# EAGLE design second (EAGLE 8.5.0)

## Sheet 1 of 2
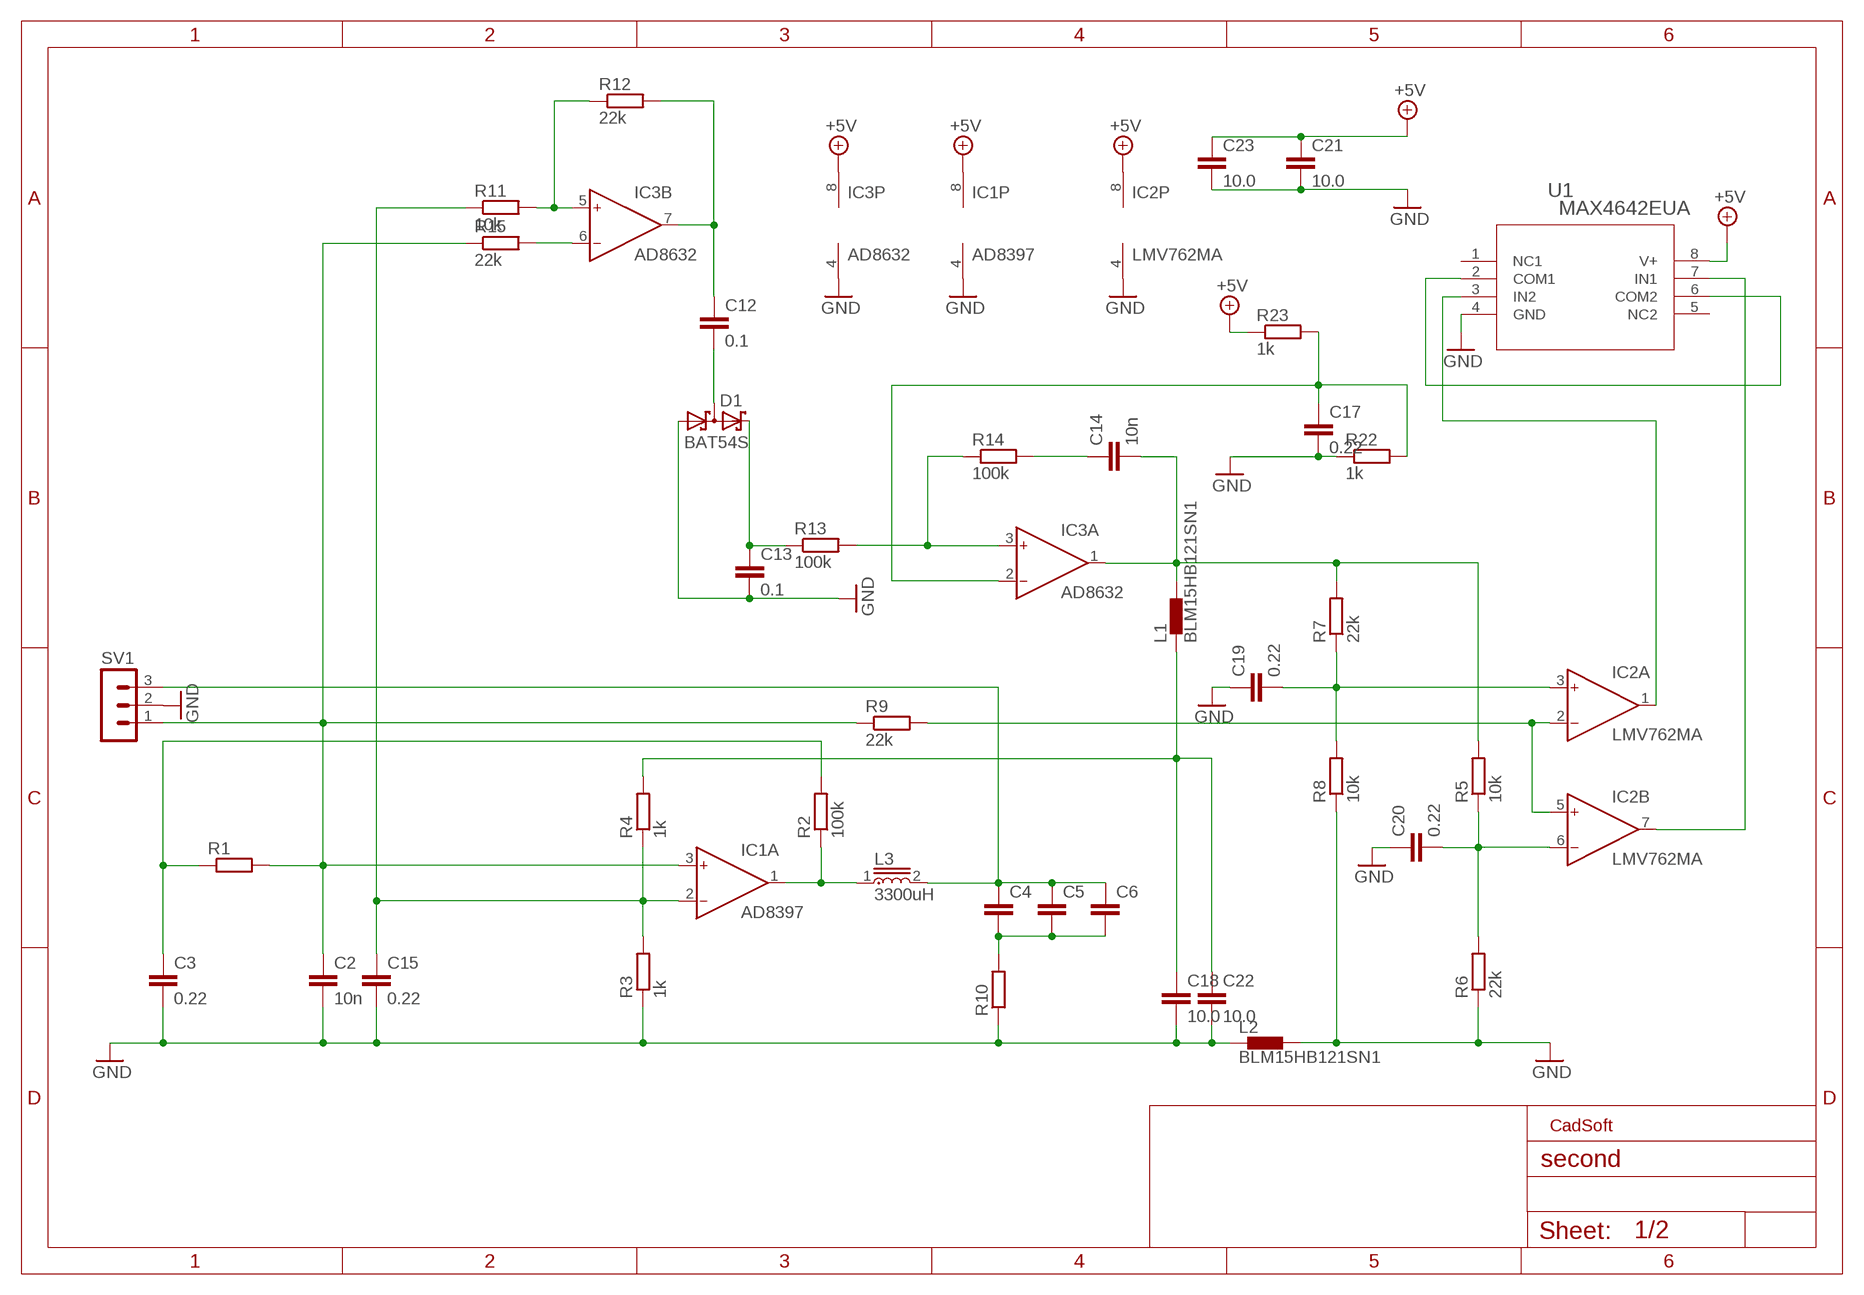
[diagram p0: schematic, sheet 1]

### Parts
C2  10n  C-EUC0805  [C0805]
C3  0.22  C-EUC0805  [C0805]
C4  C-EUC0805  [C0805]
C5  C-EUC0805  [C0805]
C6  C-EUC0805  [C0805]
C12  0.1  C-EUC0805  [C0805]
C13  0.1  C-EUC0805  [C0805]
C14  10n  C-EUC0805  [C0805]
C15  0.22  C-EUC0805  [C0805]
C17  0.22  C-EUC0805  [C0805]
C18  10.0  C-EUC0805  [C0805]
C19  0.22  C-EUC0805  [C0805]
C20  0.22  C-EUC0805  [C0805]
C21  10.0  C-EUC0805  [C0805]
C22  10.0  C-EUC0805  [C0805]
C23  10.0  C-EUC0805  [C0805]
D1  BAT54S  [SOT23]
IC1  AD8397  AD822R  [SO8]
IC2  LMV762MA  AD822R  [SO8]
IC3  AD8632  AD822R  [SO8]
L1  BLM15HB121SN1  [0402]
L2  BLM15HB121SN1  [0402]
L3  3300uH  P0762.103NL  [P0762NL]
R1  R-EU_R0805  [R0805]
R2  100k  R-EU_R0805  [R0805]
R3  1k  R-EU_R0805  [R0805]
R4  1k  R-EU_R0805  [R0805]
R5  10k  R-EU_R0805  [R0805]
R6  22k  R-EU_R0805  [R0805]
R7  22k  R-EU_R0805  [R0805]
R8  10k  R-EU_R0805  [R0805]
R9  22k  R-EU_R0805  [R0805]
R10  R-EU_R0805  [R0805]
R11  10k  R-EU_R0805  [R0805]
R12  22k  R-EU_R0805  [R0805]
R13  100k  R-EU_R0805  [R0805]
R14  100k  R-EU_R0805  [R0805]
R15  22k  R-EU_R0805  [R0805]
R22  1k  R-EU_R0805  [R0805]
R23  1k  R-EU_R0805  [R0805]
SV1  MA03-1  [MA03-1]
U1  MAX4642EUA  [21-0036K]

### Nets
+5V: C21.1 C23.1 IC1.8(P:V+) IC2.8(P:V+) IC3.8(P:V+) R23.1 U1.8(V+) ; also sheet 2
GND: C2.2 C3.2 C13.2 C15.2 C17.2 C18.2 C19.1 C20.1 C21.2 C22.2 C23.2 D1.1(A1) IC1.4(P:V-) IC2.4(P:V-) IC3.4(P:V-) L2.1 L2.2 R3.1 R6.1 R8.1 R10.1 R22.1 SV1.2 U1.4(GND) ; also sheet 2
N$1: IC2.1(A:OUT) U1.3(IN2)
N$2: U1.2(COM1) U1.6(COM2)
N$3: IC2.2(A:IN-) IC2.5(B:IN+) R9.2
N$4: C20.2 IC2.6(B:IN-) R5.1 R6.2
N$5: C19.2 IC2.3(A:IN+) R7.1 R8.2
N$7: C14.2 IC3.1(A:OUT) L1.2 R5.2 R7.2
N$8: C18.1 C22.1 L1.1 R4.2
N$9: IC2.7(B:OUT) U1.7(IN1)
N$10: C4.2 C5.2 C6.2 R10.2
N$11: C4.1 C5.1 C6.1 L3.2 SV1.3
N$13: C14.1 R14.2
N$14: IC3.3(A:IN+) R13.2 R14.1
N$16: IC1.1(A:OUT) L3.1 R2.1
N$17: C2.1 IC1.3(A:IN+) R1.2 R9.1 R15.1 SV1.1
N$19: C3.1 R1.1 R2.2
N$21: C13.1 D1.2(C2) R13.1
N$23: C12.2 D1.3(C1A2)
N$24: C12.1 IC3.7(B:OUT) R12.2
N$25: IC3.5(B:IN+) R11.2 R12.1
N$26: IC3.6(B:IN-) R15.2
N$28: C15.1 IC1.2(A:IN-) R3.2 R4.1 R11.1
N$30: C17.1 IC3.2(A:IN-) R22.2 R23.2
Unconnected: IC1.5(B:IN+) IC1.6(B:IN-) IC1.7(B:OUT) U1.1(NC1) U1.5(NC2)

### Notes on the sheet
- CadSoft

## Sheet 2 of 2
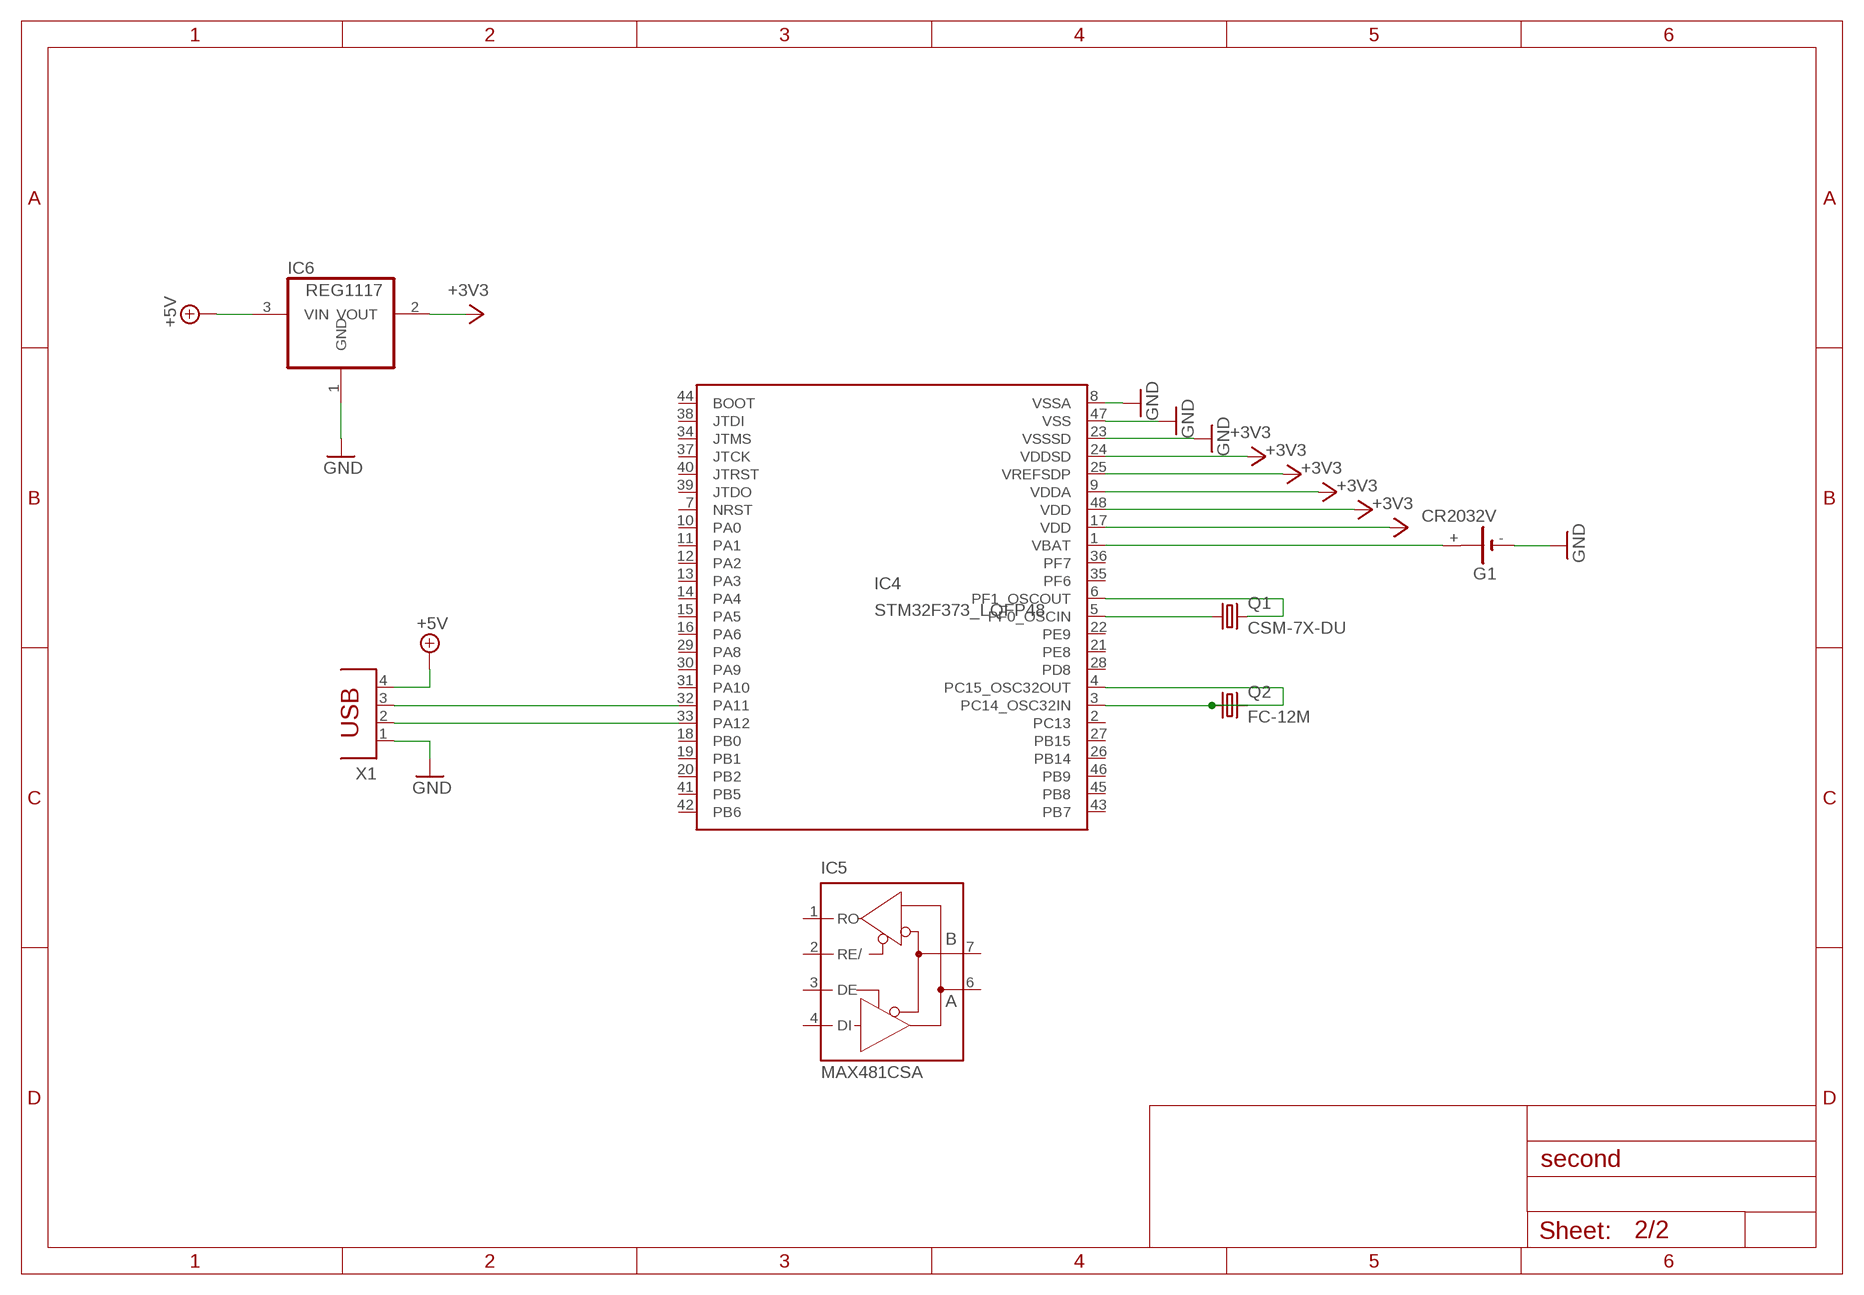
[diagram p1: schematic, sheet 2]

### Parts
G1  CR2032V  [CR2032V]
IC4  STM32F373_LQFP48  [LQFP48_PACKAGE]
IC5  MAX481CSA  [SO08]
IC6  REG1117  [SOT223]
Q1  CSM-7X-DU  [CSM-7X-DU]
Q2  FC-12M  [FC-12M]
X1  PN61729  [PN61729]

### Nets
+3V3: IC4.9(VDDA) IC4.17(VDD) IC4.24(VDDSD) IC4.25(VREFSDP) IC4.48(VDD) IC6.2(VOUT)
+5V: IC6.3(VIN) X1.4 ; also sheet 1
GND: G1.- IC4.8(VSSA) IC4.23(VSSSD) IC4.47(VSS) IC6.1(GND) X1.1 ; also sheet 1
N$6: G1.+ IC4.1(VBAT)
N$12: IC4.5(PF0_OSCIN) Q1.1
N$15: IC4.6(PF1_OSCOUT) Q1.2
N$18: IC4.3(PC14_OSC32IN) IC4.4(PC15_OSC32OUT) Q2.1
N$20: IC4.32(PA11) X1.3
N$22: IC4.33(PA12) X1.2
Unconnected: G1.+@1(+) IC4.2(PC13) IC4.7(NRST) IC4.10(PA0) IC4.11(PA1) IC4.12(PA2) IC4.13(PA3) IC4.14(PA4) IC4.15(PA5) IC4.16(PA6) IC4.18(PB0) IC4.19(PB1) IC4.20(PB2) IC4.21(PE8) IC4.22(PE9) IC4.26(PB14) IC4.27(PB15) IC4.28(PD8) IC4.29(PA8) IC4.30(PA9) IC4.31(PA10) IC4.34(JTMS) IC4.35(PF6) IC4.36(PF7) IC4.37(JTCK) IC4.38(JTDI) IC4.39(JTDO) IC4.40(JTRST) IC4.41(PB5) IC4.42(PB6) IC4.43(PB7) IC4.44(BOOT) IC4.45(PB8) IC4.46(PB9) IC5.1(RO) IC5.2(RE/) IC5.3(DE) IC5.4(DI) IC5.6(A) IC5.7(B) Q2.2

## Power pins joined to a net without a drawn wire
GND: IC5.5(GND)
VCC: IC5.8(VCC)

## Library data of the parts
C2-C6 C12-C15 C17-C23 = rcl:C-EU: CAPACITOR, European symbol; SPICEPREFIX: C
D1 = diode:BAT54S: Schottky Diodes Pin connection corrected 2011-05-04 Source: Fairchild .. BAT54.pdf
G1 = battery:CR2032V: LI BATTERY Varta
IC1-IC3 = analog-devices:AD822: Single-Supply, Rail-to-Rail Low Power FET-Input Op Amp Source: http://www.analog.com/static/imported-files/data_sheets/AD822.pdf; MF: ANALOG DEVICES; MPN: AD822BRZ; OC_FARNELL: 1651303
IC4 = analog:STM32F373_LQFP48: STM32F373_LQFP48 edit this description Auto generated by make-symbol-device-package-bsdl.ulp Rev. 44 Source: STM32F373_LQFP48.bsd
IC5 = maxim:MAX481CSA: RS485 TRANSEIVER; MF: MAXIM; MPN: MAX481CSA; OC_FARNELL: unknown; OC_NEWARK: 90C3817
IC6 = burr-brown:REG1117: 800mA and 1A Low Dropout (LDO) Positive Regulator 1.8V, 2.5V, 2.85V, 3.3V, 5V, and Adj; MPN: REG1117; OC_FARNELL: 1097566; OC_NEWARK: 14P6981
L1 L2 = inductors:BLM15H: EMIFIL (R) Chip Ferrite Bead for GHz Noise Source: http://www.murata.com/ Ferrite Bead BLM15H.pdf
L3 = inductors:P0762.*NL: Unshielded Drum Core P0762NL Series Source> http://ww2.pulseeng.com/products/datasheets/SPM2007.pdf; SPICEPREFIX: L
Q1 = crystal:CSM-7X-DU: SMD CRYSTAL Source: www.ecsxtal.com .. Crystal 3.6864MHz CSM_7X_DU.PDF; OC_FARNELL: unknown; OC_NEWARK: unknown
Q2 = crystal:FC-12M: kHz RANGE CRYSTAL UNIT LOW PROFILE SMD Source: Epson Toyocom FC-12M.pdf
R1-R15 R22 R23 = rcl:R-EU_: RESISTOR, European symbol; SPICEPREFIX: R
SV1 = con-lstb:MA03-1: PIN HEADER; OC_FARNELL: unknown; OC_NEWARK: unknown
U1 = analog:MAX4642EUA; MANUFACTURER_PART_NUMBER: max4642eua; VENDOR: Maxim Integrated Products
X1 = con-berg:PN61729: BERG USB connector; OC_FARNELL: unknown; OC_NEWARK: unknown

## Board
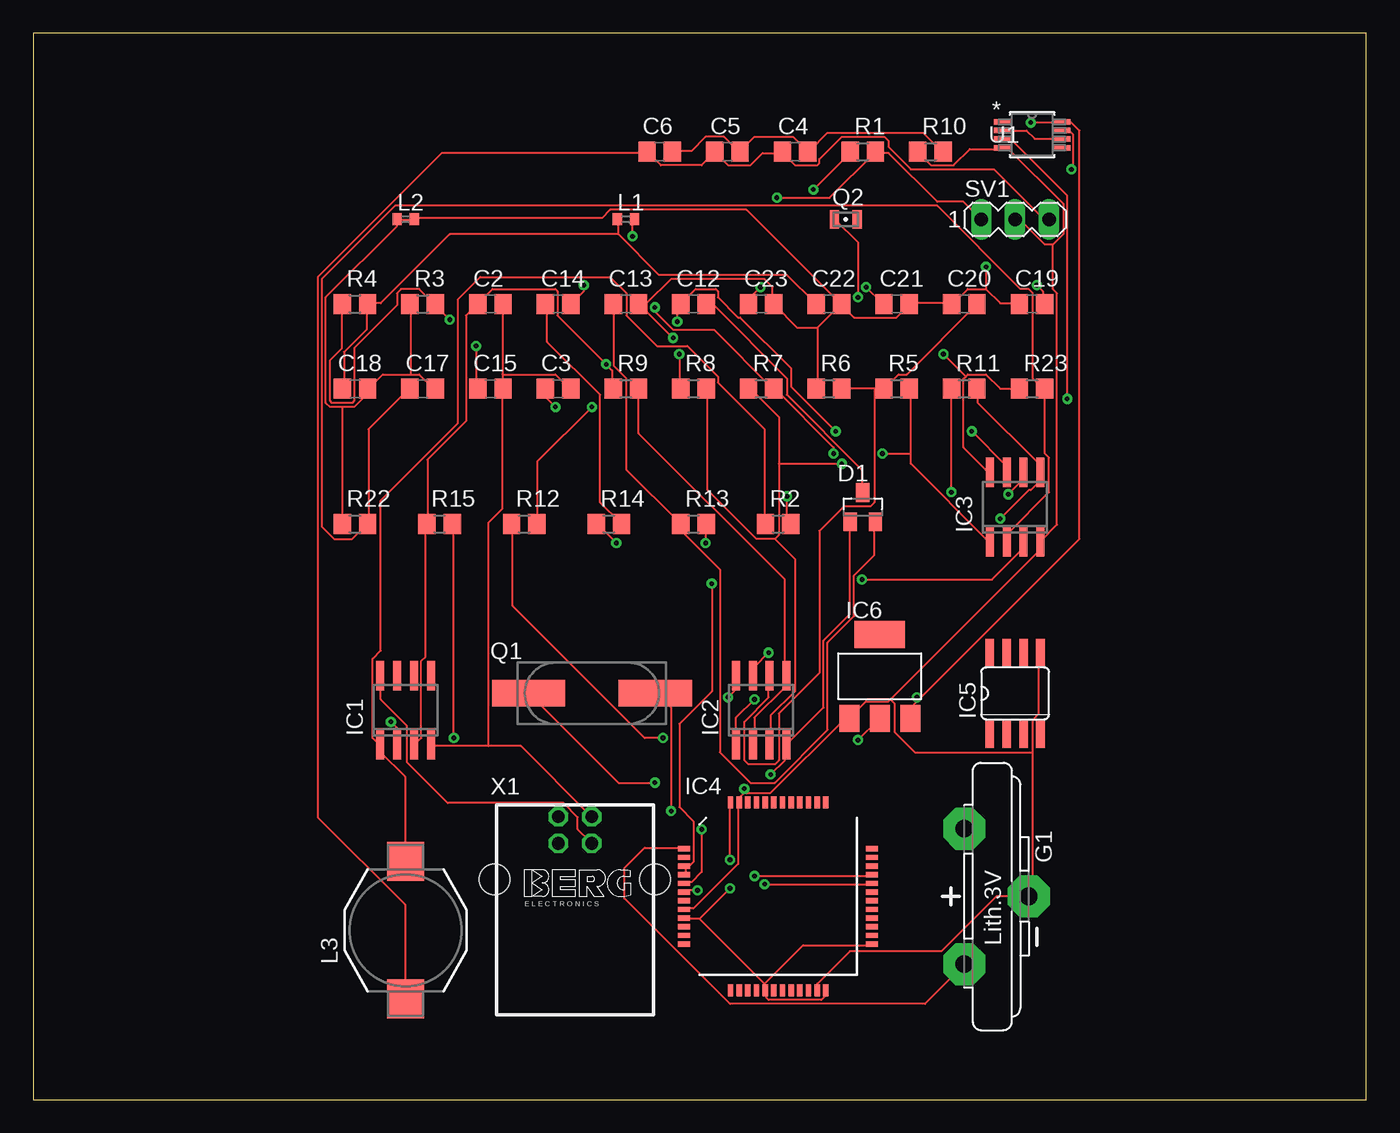
[diagram p2: board, top side]
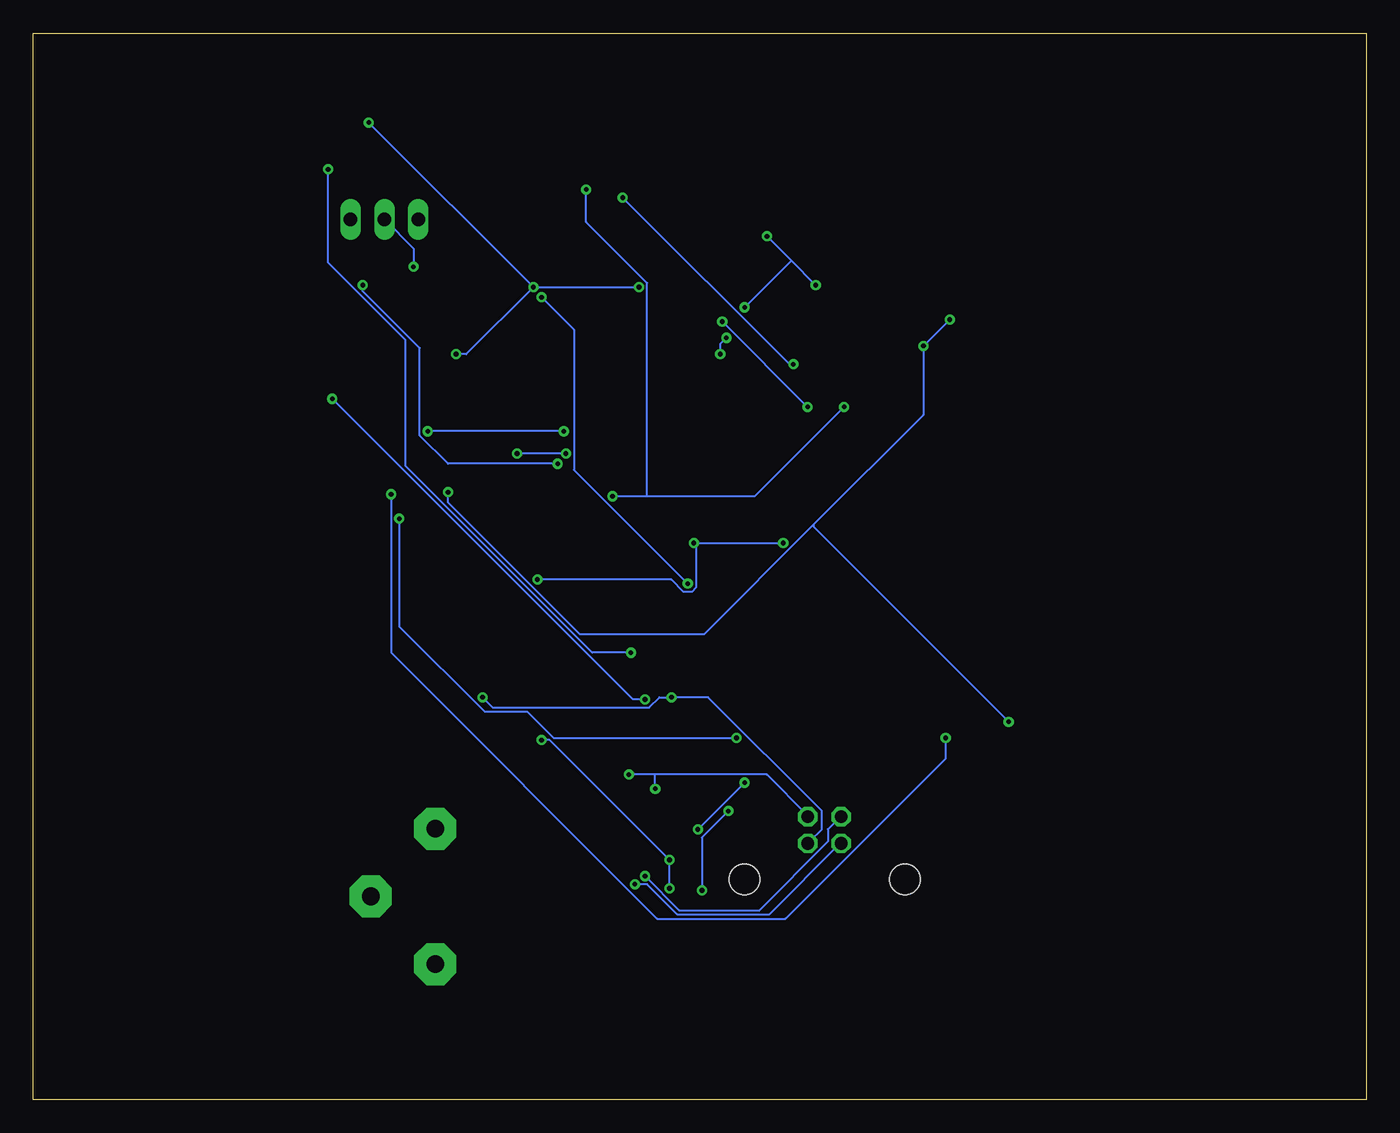
[diagram p3: board, bottom side, seen from below]

Size 100 x 80 mm. Coordinates in mm from the lower left corner, seen from the top.
Outline: 0,0 100,0 100,80 0,80 0,0
Copper layers (1*16): Top 0.035mm / dielectric 1.5mm / Bottom 0.035mm
Design rules "default": minimum track width 6mil, minimum drill 0.35mm, track to track 6mil, track to pad 6mil, pad to pad 6mil, via to via 6mil, smd to smd 6mil, copper to edge 40mil, drill to drill 6mil, minimum pad ring 10mil, minimum via ring 8mil, stop-mask expansion 4mil, vias tented up to drill 0mil, thermal gap 10mil

### Footprints (pad centres in the part's own frame; a part is rotated, then mirrored left to right if it is on the bottom)
C0805 = smd 1.3 x 1.5: 1 -0.95,0; 2 0.95,0
SOT23 = smd 1 x 1.4: 1 -0.95,-1.1; 2 0.95,-1.1; 3 0,1.1
CR2032V = drill 1.321 pad 3.15 octagon: + -2.54,-5.08; +@1 -2.54,5.08; - 2.286,0
SO8 = smd 0.6 x 2.2: 1 -1.905,-2.6; 2 -0.635,-2.6; 3 0.635,-2.6; 4 1.905,-2.6; 5 1.905,2.6; 6 0.635,2.6; 7 -0.635,2.6; 8 -1.905,2.6
LQFP48_PACKAGE = smd 0.9 x 0.4: 1 -7.05,3.575; 2 -7.05,2.925; 3 -7.05,2.275; 4 -7.05,1.625; 5 -7.05,0.975; 6 -7.05,0.325; 7 -7.05,-0.325; 8 -7.05,-0.975; 9 -7.05,-1.625; 10 -7.05,-2.275; 11 -7.05,-2.925; 12 -7.05,-3.575; 25 7.05,-3.575; 26 7.05,-2.925; 27 7.05,-2.275; 28 7.05,-1.625; 29 7.05,-0.975; 30 7.05,-0.325; 31 7.05,0.325; 32 7.05,0.975; 33 7.05,1.625; 34 7.05,2.275; 35 7.05,2.925; 36 7.05,3.575 | smd 0.4 x 0.9: 13 -3.575,-7.05; 14 -2.925,-7.05; 15 -2.275,-7.05; 16 -1.625,-7.05; 17 -0.975,-7.05; 18 -0.325,-7.05; 19 0.325,-7.05; 20 0.975,-7.05; 21 1.625,-7.05; 22 2.275,-7.05; 23 2.925,-7.05; 24 3.575,-7.05; 37 3.575,7.05; 38 2.925,7.05; 39 2.275,7.05; 40 1.625,7.05; 41 0.975,7.05; 42 0.325,7.05; 43 -0.325,7.05; 44 -0.975,7.05; 45 -1.625,7.05; 46 -2.275,7.05; 47 -2.925,7.05; 48 -3.575,7.05
SO08 = smd 0.66 x 2.032: 1 -1.905,-3.073; 2 -0.635,-3.073; 3 0.635,-3.073; 4 1.905,-3.073; 5 1.905,3.073; 6 0.635,3.073; 7 -0.635,3.073; 8 -1.905,3.073
SOT223 = smd 1.499 x 2.007: 1 -2.261,-3.15; 2 0.025,-3.15; 3 2.311,-3.15 | smd 3.81 x 2.007: 4 0,3.15
0402 = smd 0.7 x 0.9: 1 -0.65,0; 2 0.65,0
P0762NL = smd 2.794 x 2.921: 1 0,5.156; 2 0,-5.156
CSM-7X-DU = smd 5.5 x 2: 1 -4.75,0; 2 4.75,0
FC-12M = smd 0.7 x 1.4: 1 -0.85,0; 2 0.85,0
R0805 = smd 1.3 x 1.5: 1 -0.95,0; 2 0.95,0
MA03-1 = drill 1.016 long: 1 -2.54,0; 2 0,0; 3 2.54,0
21-0036K = smd 1.372 x 0.406: 1 -2.184,0.975; 2 -2.184,0.325; 3 -2.184,-0.325; 4 -2.184,-0.975; 5 2.184,-0.975; 6 2.184,-0.325; 7 2.184,0.325; 8 2.184,0.975
PN61729 = drill 0.95 octagon: 1 1.25,4.71; 2 -1.25,4.71; 3 -1.25,2.71; 4 1.25,2.71 | hole 2.3: -6.02,0; 6.02,0

### Placement (x,y rotation side)
C2  34.29,59.69 0 top
C3  39.37,53.34 0 top
C4  57.15,71.12 0 top
C5  52.07,71.12 0 top
C6  46.99,71.12 0 top
C12  49.53,59.69 0 top
C13  44.45,59.69 0 top
C14  39.37,59.69 0 top
C15  34.29,53.34 0 top
C17  29.21,53.34 0 top
C18  24.13,53.34 0 top
C19  74.93,59.69 0 top
C20  69.85,59.69 0 top
C21  64.77,59.69 0 top
C22  59.69,59.69 0 top
C23  54.61,59.69 0 top
D1  62.23,44.45 0 top
G1  72.39,15.24 0 top
IC1  27.94,29.21 0 top
IC2  54.61,29.21 0 top
IC3  73.66,44.45 0 top
IC4  55.88,15.24 0 top
IC5  73.66,30.48 0 top
IC6  63.5,31.75 0 top
L1  44.45,66.04 0 top
L2  27.94,66.04 0 top
L3  27.94,12.7 0 top
Q1  41.91,30.48 0 top
Q2  60.96,66.04 0 top
R1  62.23,71.12 0 top
R2  55.88,43.18 0 top
R3  29.21,59.69 0 top
R4  24.13,59.69 0 top
R5  64.77,53.34 0 top
R6  59.69,53.34 0 top
R7  54.61,53.34 0 top
R8  49.53,53.34 0 top
R9  44.45,53.34 0 top
R10  67.31,71.12 0 top
R11  69.85,53.34 0 top
R12  36.83,43.18 0 top
R13  49.53,43.18 0 top
R14  43.18,43.18 0 top
R15  30.48,43.18 0 top
R22  24.13,43.18 0 top
R23  74.93,53.34 0 top
SV1  73.66,66.04 0 top
U1  74.93,72.39 0 top
X1  40.64,16.51 0 top

### Tracks (layer width: path | path; a pad name or v marks a point on that pad's centre or on a via)
+3V3  (via drill 0.35)
  Top 0.152: IC4.24 59.44,8.08 59.44,7.77 59.13,7.47 55.17,7.47 55.02,7.62 55.02,8.08 IC4.17 54.86,8.23 54.86,8.69 | 49.99,13.56 48.92,13.56 IC4.9 | 54.86,8.69 49.99,13.56 | v52.27,17.98 52.27,22.25 IC4.48 | 49.99,13.56 v52.27,15.85 | 54.86,8.69 57.76,11.58 62.79,11.58 IC4.25 | v61.87,26.98 63.4,28.5 IC6.2
  Bottom 0.152: v52.27,15.85 v52.27,17.98 61.27,26.98 v61.87,26.98
+5V  (via drill 0.35)
  Top 0.152: IC1.8 26.06,31.7 26.06,30.02 28.04,28.04 28.04,25.3 31.09,22.25 39.78,22.25 40.84,21.18 40.84,20.27 41.76,19.36 X1.4 | v52.12,30.18 52.58,30.63 52.58,31.7 IC2.8 | R23.1 72.54,53.34 71.48,54.41 70.1,54.41 69.95,54.25 | 69.95,54.25 69.8,54.1 69.8,48.92 71.63,47.09 IC3.8 | v54.56,60.96 53.8,60.2 53.8,59.74 C23.1 | v62.48,60.96 63.7,59.74 C21.1 | v68.28,55.93 69.95,54.25 | 77.11,73.3 77.88,73.3 78.49,72.69 78.49,42.06 66.45,30.02 | 66.45,30.02 65.84,29.41 65.84,28.65 IC6.3 | 77.11,73.3 v74.83,73.3 | 77.11,73.3 U1.8 | 66.45,30.02 v66.29,30.18
  Bottom 0.152: X1.4 41.76,19.36 40.84,20.27 40.84,21.64 49.38,30.18 v52.12,30.18 53.03,30.18 53.8,29.41 65.53,29.41 v66.29,30.18 | v62.48,60.96 v54.56,60.96 | v68.28,55.93 67.51,55.93 v62.48,60.96 | v74.83,73.3 v62.48,60.96
GND  (via drill 0.35)
  Top 0.152: 23.16,51.97 24.08,51.97 24.99,52.88 24.99,53.34 C18.2 25.15,53.34 26.21,54.41 28.35,54.41 | 23.16,51.97 22.25,51.97 21.95,52.27 21.95,60.2 27.28,65.53 27.28,65.99 L2.1 27.43,65.99 28.5,65.99 L2.2 28.65,66.14 42.67,66.14 43.28,66.75 53.49,66.75 60.5,59.74 C22.2 | 23.16,51.97 23.16,43.28 R22.1 | 28.35,54.41 28.96,54.41 30.02,53.34 C17.2 | 28.35,54.41 28.35,59.59 R3.1 | 71.48,60.81 72.54,59.74 73.91,59.74 C19.1 | 71.48,60.81 70.1,60.81 69.04,59.74 C20.1 68.89,59.74 65.84,59.74 C21.2 65.68,59.59 64.77,58.67 61.57,58.67 60.66,59.59 C22.2 | 58.83,57.91 58.83,53.34 R6.1 | 58.83,57.91 60.5,59.59 C22.2 | 46.02,59.74 45.41,59.74 C13.2 46.02,59.74 | 46.02,59.74 47.85,61.57 54.86,61.57 55.47,60.96 55.47,59.74 C23.2 55.63,59.59 57.3,57.91 58.83,57.91 | v48.46,55.93 48.46,53.34 R8.1 | v48.01,57.15 46.02,59.13 46.02,59.74 | D1.1 61.27,43.28 61.27,36.42 59.28,34.44 59.28,29.41 56.54,26.67 IC2.4 56.39,26.52 56.39,25.45 v55.32,24.38 | 35.2,54.41 35.2,59.59 C2.2 | 35.2,54.41 35.2,53.34 | 35.2,54.41 39.17,54.41 40.23,53.34 C3.2 | 34.14,26.52 36.58,26.52 41.76,21.34 X1.1 | 34.14,26.52 29.87,26.52 IC1.4 | 35.2,53.34 35.2,44.35 34.14,43.28 34.14,26.52 | 35.2,53.34 C15.2 | IC4.23 58.83,8.23 58.83,8.69 61.27,11.12 68.12,11.12 72.24,15.24 G1.- 74.98,15.54 74.98,26.06 | 74.98,26.06 74.98,28.5 75.44,28.96 75.44,33.53 IC5.5 | R10.1 66.45,71.02 67.36,70.1 69.04,70.1 70.26,71.32 72.69,71.32 U1.4 72.85,71.32 73.15,71.32 77.27,67.21 77.27,64.92 76.5,64.16 | 76.5,64.16 75.89,64.16 74.07,65.99 73.76,65.99 SV1.2 | IC4.8 48.92,14.33 49.53,14.33 52.88,17.68 52.88,22.25 IC4.47 53.03,22.4 53.03,22.71 53.34,23.01
  Top 0.152: 53.34,23.01 55.32,23.01 60.81,28.5 61.11,28.5 IC6.1 61.27,28.65 62.48,29.87 64.16,29.87 64.31,30.02 | 64.31,30.02 75.44,41.15 75.44,41.76 IC3.4 75.59,41.91 76.81,43.13 76.81,60.5 76.5,60.81 76.5,64.16 | 74.98,26.06 66.14,26.06 64.62,27.58 64.62,29.72 64.31,30.02 | 53.34,23.01 v53.34,23.32 | v71.48,62.48 71.48,60.81
  Bottom 0.152: v48.46,55.93 48.46,56.69 v48.01,57.15 | 53.34,24.38 44.96,24.38 41.91,21.34 X1.1 | 53.34,24.38 v55.32,24.38 | v53.34,23.32 53.34,24.38 | v71.48,62.48 71.48,63.86 SV1.2
N$1  (via drill 0.35)
  Top 0.152: v77.57,52.58 77.57,67.82 73.46,71.93 72.85,71.93 U1.3 | v54.1,30.02 52.73,28.65 52.73,26.67 IC2.1
  Bottom 0.152: v77.57,52.58 55.02,30.02 v54.1,30.02
N$2
  Top 0.152: U1.6 77.11,72.08 75.13,72.08 74.52,72.69 72.85,72.69 U1.2
N$3
  Top 0.152: R9.2 45.41,53.34 45.41,49.99 56.39,39.01 56.39,31.85 IC2.5 56.39,31.7 56.39,30.94 54.1,28.65 54.1,26.67 IC2.2
N$4
  Top 0.152: 63.09,53.34 R5.1 63.86,53.34 64.92,54.41 65.53,54.41 70.71,59.59 C20.2 | 63.09,53.34 R6.2 | 63.09,53.34 63.09,44.81 62.79,44.5 60.81,44.5 58.98,42.67 58.98,32 55.93,28.96 55.93,25.45 55.63,25.15 53.65,25.15 53.34,25.45 53.34,28.35 55.17,30.18 55.17,31.7 IC2.6
N$5  (via drill 0.35)
  Top 0.152: 55.63,42.06 54.25,42.06 50.6,45.72 50.6,53.34 R8.2 | 55.63,42.06 55.93,42.37 55.93,47.7 | 55.93,47.7 55.93,51.21 53.8,53.34 R7.1 | v75.29,61.11 75.74,60.66 75.74,59.74 C19.2 | 55.93,47.7 v60.66,47.7 | 55.63,42.06 57.15,40.54 57.15,30.63 55.32,28.8 55.32,26.67 IC2.3
  Bottom 0.152: v75.29,61.11 75.29,60.66 71.02,56.39 71.02,49.84 68.89,47.7 v60.66,47.7
N$6
  Top 0.152: IC4.1 48.77,18.9 45.87,18.9 44.35,17.37 44.35,15.09 52.27,7.16 66.9,7.16 69.8,10.06 G1.+
N$7  (via drill 0.35)
  Top 0.152: 65.84,48.46 65.84,47.7 71.63,41.91 IC3.1 | 65.84,48.46 65.84,53.34 R5.2 | v44.96,64.77 44.96,65.99 L1.2 | v41.3,61.11 41.3,60.66 40.39,59.74 C14.2 | v46.63,59.44 46.63,59.13 48.01,57.76 51.05,57.76 55.47,53.34 R7.2 55.63,53.34 60.05,48.92 v60.05,48.46 | v63.7,48.46 65.84,48.46
  Bottom 0.152: v41.3,61.11 43.13,62.94 | 43.13,62.94 v44.96,64.77 | 43.13,62.94 v46.63,59.44 | v60.05,48.46 v63.7,48.46
N$8
  Top 0.152: C18.1 23.32,53.34 23.32,56.08 24.99,57.76 24.99,59.59 R4.2 25.15,59.74 26.06,59.74 31.24,64.92 43.89,64.92 | 43.89,64.92 43.89,65.99 L1.1 | 43.89,64.92 46.94,61.87 56.54,61.87 58.67,59.74 C22.1
N$9  (via drill 0.35)
  Top 0.152: v77.88,69.8 78.03,69.95 78.03,72.39 77.72,72.69 77.11,72.69 U1.7 | v55.17,33.53 54.1,32.46 54.1,31.85 IC2.7
  Bottom 0.152: v77.88,69.8 77.88,62.79 72.08,57 72.08,47.55 58.06,33.53 v55.17,33.53
N$10
  Top 0.152: C6.2 48.01,71.17 49.38,71.17 50.44,72.24 51.82,72.24 52.88,71.17 C5.2 53.03,71.17 54.1,72.24 57,72.24 58.06,71.17 C4.2 58.22,71.17 59.59,72.54 66.75,72.54 68.12,71.17 R10.2
N$11
  Top 0.152: L3.2 27.89,7.62 27.89,14.63 21.34,21.18 21.34,61.72 30.63,71.02 46.02,71.02 C6.1 46.18,71.02 47.09,70.1 50.14,70.1 51.05,71.02 C5.1 51.21,71.02 52.12,70.1 53.8,70.1 54.71,71.02 56.08,71.02 C4.1 56.24,71.02 57.15,70.1 58.83,70.1 58.98,70.26 58.98,70.56 60.66,72.24 63.86,72.24 64.16,71.93 64.16,71.48 65.84,69.8 72.08,69.8 75.74,66.14 76.2,66.14 SV1.3
N$12  (via drill 0.35)
  Top 0.152: v50.14,20.27 50.14,17.07 49.38,16.31 48.92,16.31 IC4.5 | v46.63,23.77 43.89,23.77 37.19,30.48 Q1.1
  Bottom 0.152: v46.63,23.77 v50.14,20.27
N$13
  Top 0.152: C14.1 38.56,59.59 38.56,56.84 42.52,52.88 42.52,44.81 44.04,43.28 R14.2
N$14  (via drill 0.35)
  Top 0.152: v43.74,41.76 42.37,43.13 R14.1 | v50.44,41.76 50.44,43.13 R13.2 | v62.18,39.01 71.93,39.01 74.22,41.3 74.22,41.76 IC3.3
  Bottom 0.152: 50.29,41.76 v43.74,41.76 | v62.18,39.01 52.12,39.01 51.21,38.1 50.6,38.1 50.29,38.41 50.29,41.76 | 50.29,41.76 v50.44,41.76
N$15  (via drill 0.35)
  Top 0.152: v49.84,15.7 48.92,15.7 IC4.6 | v47.85,21.64 47.85,29.41 46.79,30.48 Q1.2
  Bottom 0.152: v49.84,15.7 49.84,19.66 v47.85,21.64
N$16
  Top 0.152: R2.1 54.86,43.28 54.86,50.29 51.36,53.8 51.36,54.25 49.07,56.54 46.79,56.54 44.5,58.83 44.5,60.5 43.28,61.72 33.53,61.72 31.85,60.05 31.85,50.75 26.06,44.96 26.06,33.68 25.45,33.07 25.45,27.13 25.91,26.67 IC1.1 26.06,26.52 26.06,26.06 27.89,24.23 27.89,17.98 L3.1
N$17  (via drill 0.35)
  Top 0.152: IC1.3 28.65,26.67 29.11,27.13 29.11,32.92 29.41,33.22 29.41,43.13 R15.1 29.57,43.28 29.57,48.01 32.46,50.9 32.46,58.83 33.22,59.59 C2.1 33.38,59.74 34.44,60.81 39.17,60.81 39.32,60.66 39.32,58.83 v42.98,55.17 43.43,54.71 43.43,53.34 R9.1 | SV1.1 69.8,67.36 67.82,67.36 64.16,71.02 63.25,71.02 R1.2 63.09,71.02 59.74,67.67 v55.78,67.67
  Bottom 0.152: v55.78,67.67 43.28,55.17 v42.98,55.17
N$18  (via drill 0.35)
  Top 0.152: IC4.4 48.92,16.92 48.92,17.37 IC4.3 48.92,17.53 49.23,17.53 49.53,17.83 49.53,20.88 48.46,21.95 48.46,28.19 50.9,30.63 v50.9,38.71 | v61.87,60.2 61.87,64.31 60.2,65.99 Q2.1
  Bottom 0.152: v50.9,38.71 59.44,47.24 59.44,57.76 v61.87,60.2
N$19  (via drill 0.35)
  Top 0.152: v39.17,51.97 38.56,52.58 38.56,53.34 C3.1 | v56.54,45.26 56.54,43.43 56.69,43.28 R2.2 | v58.52,68.28 61.27,71.02 R1.1
  Bottom 0.152: v39.17,51.97 45.87,45.26 53.95,45.26 | v56.54,45.26 53.95,45.26 | v58.52,68.28 58.52,65.84 53.95,61.27 53.95,45.26
N$20  (via drill 0.35)
  Top 0.152: v54.86,16.15 62.79,16.15 IC4.32
  Bottom 0.152: v54.86,16.15 53.95,16.15 51.66,13.87 44.81,13.87 39.47,19.2 X1.3
N$21
  Top 0.152: D1.2 63.09,43.28 63.09,40.84 61.57,39.32 61.57,36.27 59.59,34.29 59.59,27.74 55.63,23.77 53.8,23.77 51.51,26.06 51.51,39.78 48.62,42.67 48.62,43.13 R13.1 48.46,43.28 44.5,47.24 44.5,54.1 43.59,55.02 43.59,59.59 C13.1
N$22  (via drill 0.35)
  Top 0.152: v54.1,16.76 62.79,16.76 IC4.33
  Bottom 0.152: v54.1,16.76 51.51,14.17 45.57,14.17 40.39,19.36 40.39,20.27 39.47,21.18 X1.2
N$23
  Top 0.152: D1.3 62.18,45.57 62.18,47.24 56.54,52.88 56.54,54.1 51.05,59.59 50.6,59.59 C12.2
N$24  (via drill 0.35)
  Top 0.152: v41.91,51.97 37.8,47.85 37.8,43.28 R12.2 | v48.31,58.37 48.31,59.44 48.46,59.59 C12.1 48.62,59.74 49.68,60.81 51.21,60.81 51.36,60.66 51.36,60.2 52.88,58.67 53.03,58.67 56.84,54.86 56.84,53.49 v60.2,50.14 | v70.41,50.14 73,47.55 73,47.09 IC3.7
  Bottom 0.152: v48.31,58.37 v41.91,51.97 | v60.2,50.14 v70.41,50.14
N$25  (via drill 0.35)
  Top 0.152: v47.24,27.13 45.87,27.13 35.97,37.03 35.97,43.13 R12.1 | v72.54,43.59 74.68,45.72 74.83,45.72 75.44,46.33 75.44,46.94 IC3.5 75.44,47.09 75.44,47.7 70.87,52.27 70.87,53.34 R11.2
  Bottom 0.152: v47.24,27.13 60.96,27.13 62.94,29.11 66.14,29.11 72.54,35.51 v72.54,43.59
N$26  (via drill 0.35)
  Top 0.152: v31.55,27.13 31.55,43.13 R15.2 | v73.15,45.41 74.22,46.48 74.22,46.94 IC3.6
  Bottom 0.152: v31.55,27.13 31.55,25.6 43.59,13.56 53.19,13.56 73.15,33.53 v73.15,45.41
N$28  (via drill 0.35)
  Top 0.152: R4.1 23.16,59.59 23.16,56.39 22.25,55.47 22.25,52.43 22.4,52.27 23.93,52.27 24.08,52.43 24.08,56.39 27.28,59.59 27.28,60.5 27.58,60.81 28.96,60.81 30.02,59.74 R3.2 30.18,59.59 v31.24,58.52 | v33.22,56.54 33.22,53.34 C15.1 | v68.89,45.57 68.89,53.34 R11.1 | v26.82,28.35 27.28,27.89 27.28,26.67 IC1.2
  Bottom 0.152: v31.24,58.52 v33.22,56.54 33.22,51.36 41.45,43.13 | v68.89,45.57 68.89,44.81 58.98,34.9 49.68,34.9 41.45,43.13 | v26.82,28.35 41.45,42.98 41.45,43.13
N$30
  Top 0.152: C17.1 28.19,53.34 25.15,50.29 25.15,43.28 R22.2 24.99,43.13 23.93,42.06 22.55,42.06 21.64,42.98 21.64,61.57 27.13,67.06 67.82,67.06 74.07,60.81 74.68,60.81 74.98,60.5 74.98,54.1 75.74,53.34 R23.2 75.89,53.34 75.89,48.46 76.2,48.16 76.2,45.57 73.15,42.52 73.15,41.91 IC3.2